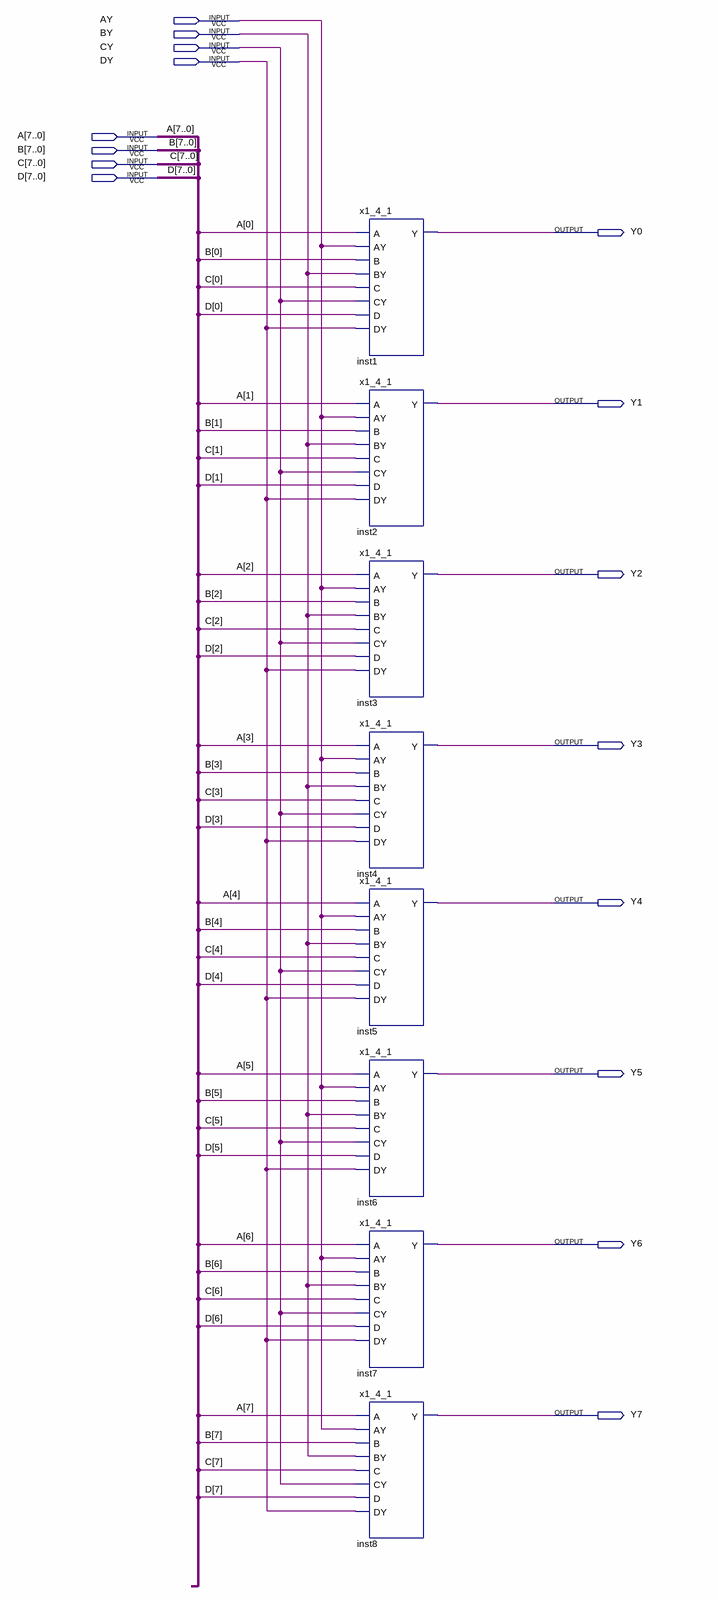
[diagram p0: schematic sheet]
// Quartus schematic x8_4_1.bdf as structural Verilog: 8 symbols, 16 pins
module x8_4_1 (
  input  AY,
  input  BY,
  input  CY,
  input  DY,
  input  [7:0] A,
  input  [7:0] B,
  input  [7:0] C,
  input  [7:0] D,
  output Y0,
  output Y1,
  output Y2,
  output Y3,
  output Y4,
  output Y5,
  output Y6,
  output Y7
);

  x1_4_1 inst1 (.A(A[0]), .AY(AY), .B(B[0]), .BY(BY), .C(C[0]), .CY(CY), .D(D[0]), .DY(DY), .Y(Y0));
  x1_4_1 inst2 (.A(A[1]), .AY(AY), .B(B[1]), .BY(BY), .C(C[1]), .CY(CY), .D(D[1]), .DY(DY), .Y(Y1));
  x1_4_1 inst3 (.A(A[2]), .AY(AY), .B(B[2]), .BY(BY), .C(C[2]), .CY(CY), .D(D[2]), .DY(DY), .Y(Y2));
  x1_4_1 inst4 (.A(A[3]), .AY(AY), .B(B[3]), .BY(BY), .C(C[3]), .CY(CY), .D(D[3]), .DY(DY), .Y(Y3));
  x1_4_1 inst5 (.A(A[4]), .AY(AY), .B(B[4]), .BY(BY), .C(C[4]), .CY(CY), .D(D[4]), .DY(DY), .Y(Y4));
  x1_4_1 inst6 (.A(A[5]), .AY(AY), .B(B[5]), .BY(BY), .C(C[5]), .CY(CY), .D(D[5]), .DY(DY), .Y(Y5));
  x1_4_1 inst7 (.A(A[6]), .AY(AY), .B(B[6]), .BY(BY), .C(C[6]), .CY(CY), .D(D[6]), .DY(DY), .Y(Y6));
  x1_4_1 inst8 (.A(A[7]), .AY(AY), .B(B[7]), .BY(BY), .C(C[7]), .CY(CY), .D(D[7]), .DY(DY), .Y(Y7));
endmodule
